# Altium schematic sheet Demux.SchDoc: QUTMS Shutdown V2.1 - Demux
size A3; Organization: QUT Motorsport; Address1: O-120; Address2: O Block; Address3: QUT Gardnes Point; Address4: Brisbane, 4000; DocumentNumber: 4; Revision: 6; SheetNumber: 4; SheetTotal: 4
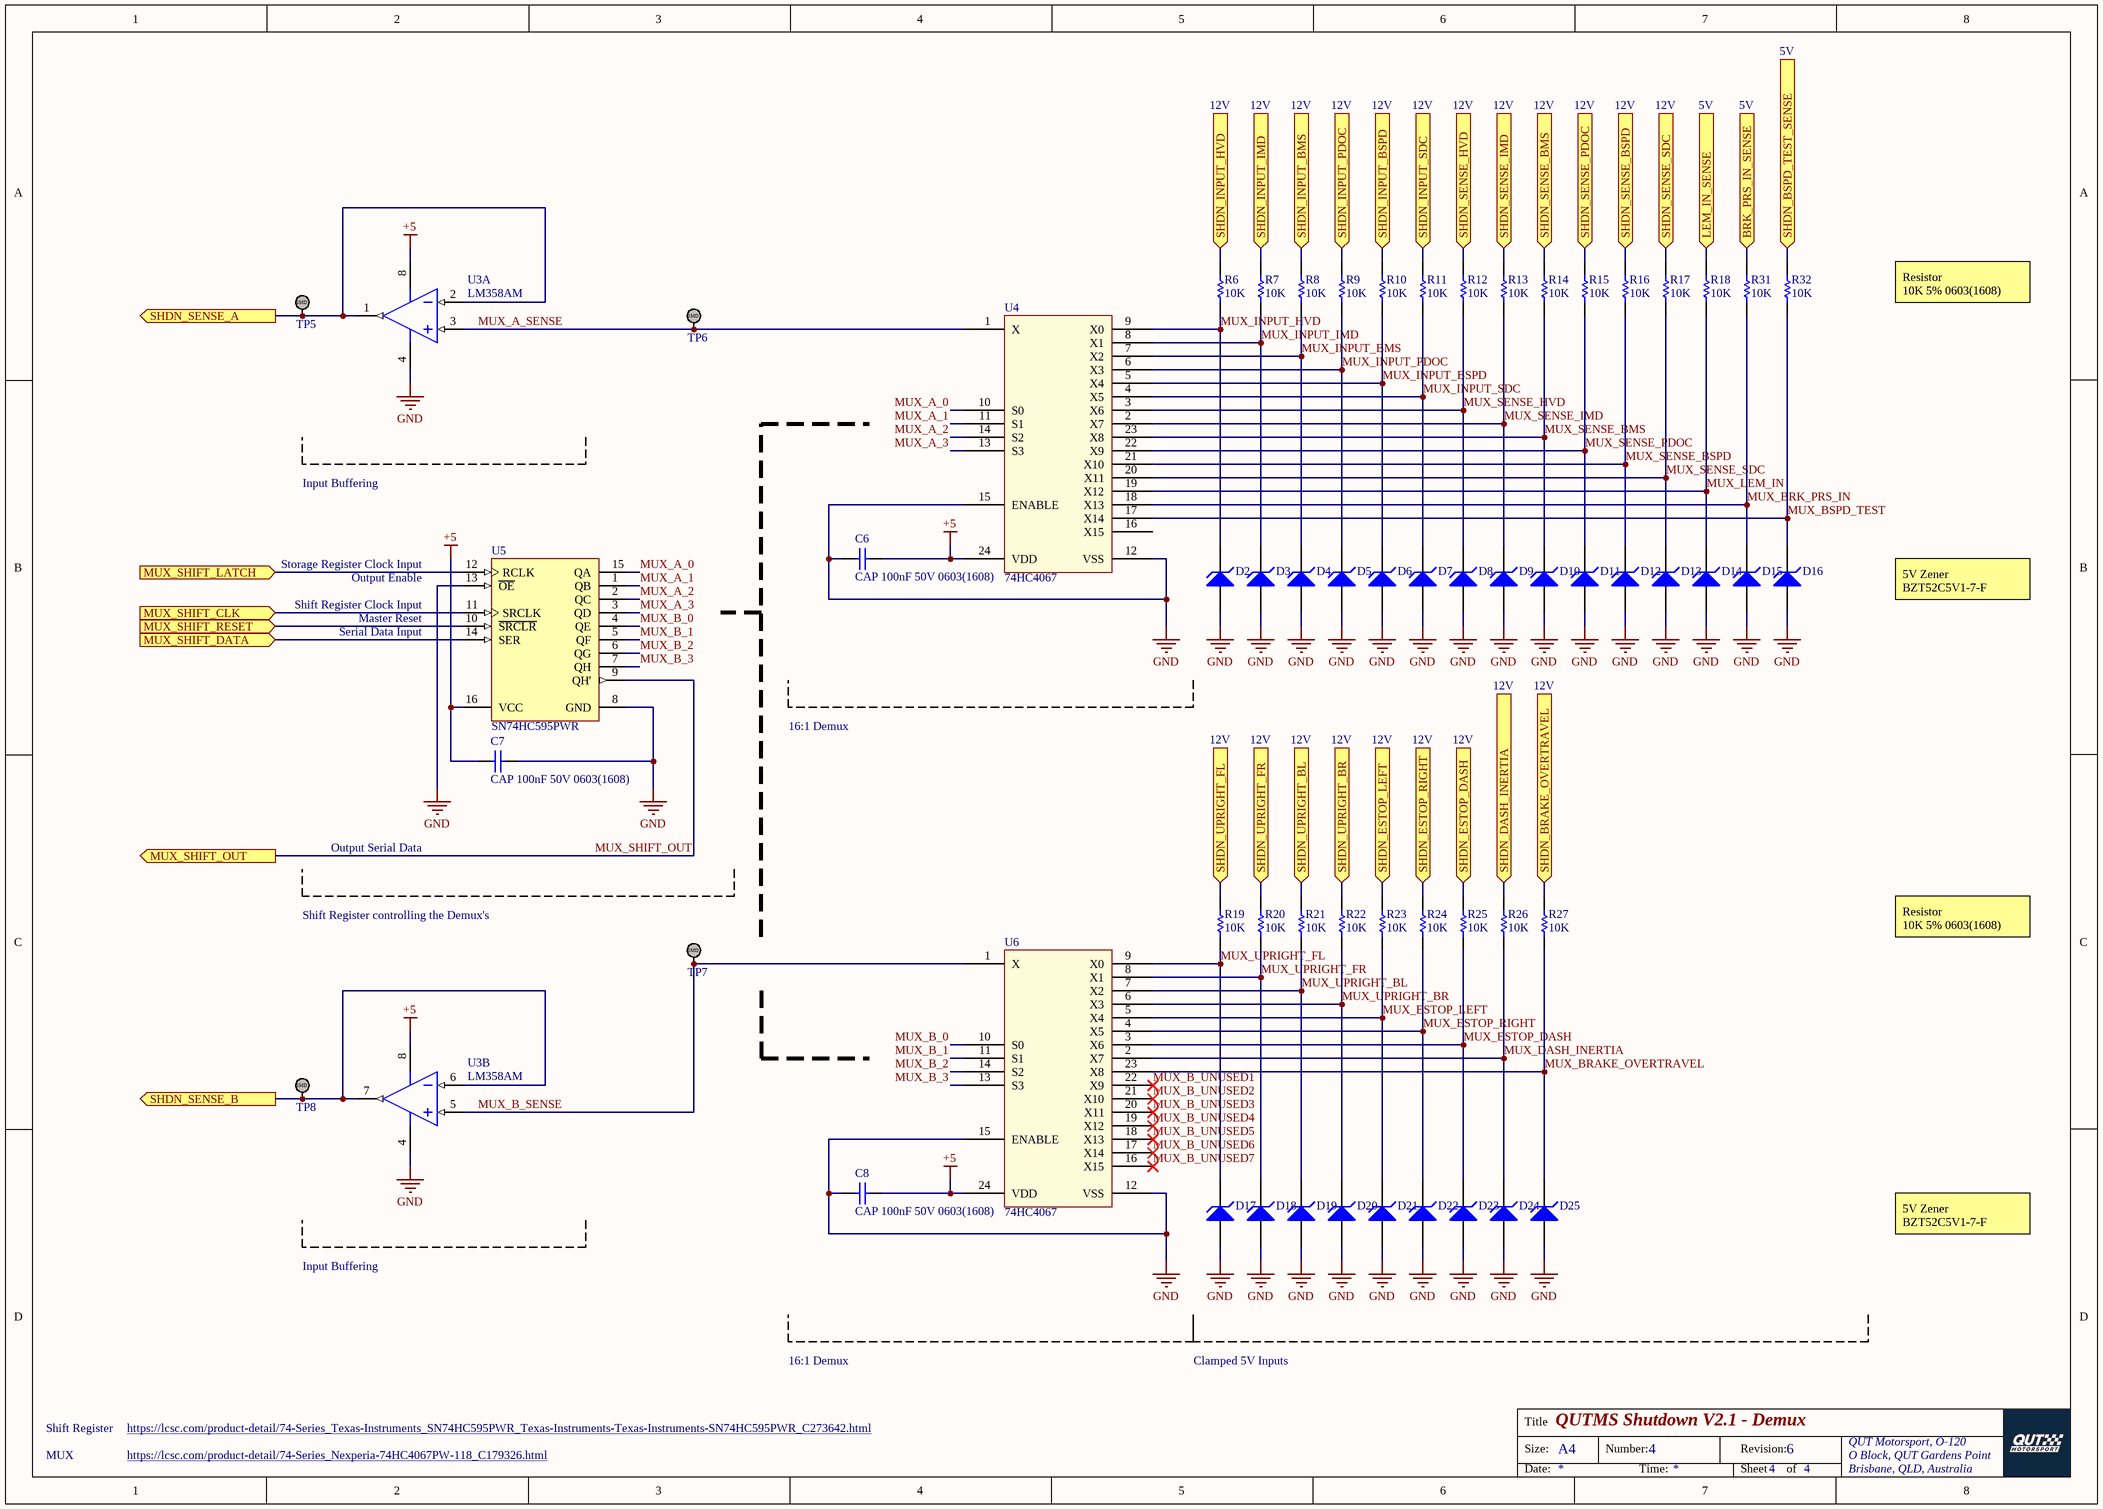
[diagram p0: Demux.SchDoc]

## Parts
C6  CAP 100nF 50V 0603(1608)  [CAPC0603(1608)100_L]
C7  CAP 100nF 50V 0603(1608)  [CAPC0603(1608)100_L]
C8  CAP 100nF 50V 0603(1608)  [CAPC0603(1608)100_L]
D2  BZT52C5V1-7-F  [DIOD-SOD123_V]  (value not drawn)
D3  BZT52C5V1-7-F  [DIOD-SOD123_V]  (value not drawn)
D4  BZT52C5V1-7-F  [DIOD-SOD123_V]  (value not drawn)
D5  BZT52C5V1-7-F  [DIOD-SOD123_V]  (value not drawn)
D6  BZT52C5V1-7-F  [DIOD-SOD123_V]  (value not drawn)
D7  BZT52C5V1-7-F  [DIOD-SOD123_V]  (value not drawn)
D8  BZT52C5V1-7-F  [DIOD-SOD123_V]  (value not drawn)
D9  BZT52C5V1-7-F  [DIOD-SOD123_V]  (value not drawn)
D10  BZT52C5V1-7-F  [DIOD-SOD123_V]  (value not drawn)
D11  BZT52C5V1-7-F  [DIOD-SOD123_V]  (value not drawn)
D12  BZT52C5V1-7-F  [DIOD-SOD123_V]  (value not drawn)
D13  BZT52C5V1-7-F  [DIOD-SOD123_V]  (value not drawn)
D14  BZT52C5V1-7-F  [DIOD-SOD123_V]  (value not drawn)
D15  BZT52C5V1-7-F  [DIOD-SOD123_V]  (value not drawn)
D16  BZT52C5V1-7-F  [DIOD-SOD123_V]  (value not drawn)
D17  BZT52C5V1-7-F  [DIOD-SOD123_V]  (value not drawn)
D18  BZT52C5V1-7-F  [DIOD-SOD123_V]  (value not drawn)
D19  BZT52C5V1-7-F  [DIOD-SOD123_V]  (value not drawn)
D20  BZT52C5V1-7-F  [DIOD-SOD123_V]  (value not drawn)
D21  BZT52C5V1-7-F  [DIOD-SOD123_V]  (value not drawn)
D22  BZT52C5V1-7-F  [DIOD-SOD123_V]  (value not drawn)
D23  BZT52C5V1-7-F  [DIOD-SOD123_V]  (value not drawn)
D24  BZT52C5V1-7-F  [DIOD-SOD123_V]  (value not drawn)
D25  BZT52C5V1-7-F  [DIOD-SOD123_V]  (value not drawn)
R6  10K  [RESC0603(1608)_N]
R7  10K  [RESC0603(1608)_N]
R8  10K  [RESC0603(1608)_N]
R9  10K  [RESC0603(1608)_N]
R10  10K  [RESC0603(1608)_N]
R11  10K  [RESC0603(1608)_N]
R12  10K  [RESC0603(1608)_N]
R13  10K  [RESC0603(1608)_N]
R14  10K  [RESC0603(1608)_N]
R15  10K  [RESC0603(1608)_N]
R16  10K  [RESC0603(1608)_N]
R17  10K  [RESC0603(1608)_N]
R18  10K  [RESC0603(1608)_N]
R19  10K  [RESC0603(1608)_N]
R20  10K  [RESC0603(1608)_N]
R21  10K  [RESC0603(1608)_N]
R22  10K  [RESC0603(1608)_N]
R23  10K  [RESC0603(1608)_N]
R24  10K  [RESC0603(1608)_N]
R25  10K  [RESC0603(1608)_N]
R26  10K  [RESC0603(1608)_N]
R27  10K  [RESC0603(1608)_N]
R31  10K  [RESC0603(1608)_N]
R32  10K  [RESC0603(1608)_N]
TP5  TestPoint_SMD  [TestPointSMD]  (value not drawn)
TP6  TestPoint_SMD  [TestPointSMD]  (value not drawn)
TP7  TestPoint_SMD  [TestPointSMD]  (value not drawn)
TP8  TestPoint_SMD  [TestPointSMD]  (value not drawn)
U3  LM358AM  [D0008A_M]  (parts A,B of 2)
U4  74HC4067  [74HC4067 TSSOP24]
U5  SN74HC595PWR  [PW0016A_L]
U6  74HC4067  [74HC4067 TSSOP24]

## Ports
BRK_PRS_IN_SENSE (in), LEM_IN_SENSE (in), MUX_SHIFT_CLK (in), MUX_SHIFT_DATA (in), MUX_SHIFT_LATCH (in), MUX_SHIFT_OUT (out), MUX_SHIFT_RESET (in), SHDN_BRAKE_OVERTRAVEL (in), SHDN_BSPD_TEST_SENSE (in), SHDN_DASH_INERTIA (in), SHDN_ESTOP_DASH (in), SHDN_ESTOP_LEFT (in), SHDN_ESTOP_RIGHT (in), SHDN_INPUT_BMS (in), SHDN_INPUT_BSPD (in), SHDN_INPUT_HVD (in), SHDN_INPUT_IMD (in), SHDN_INPUT_PDOC (in), SHDN_INPUT_SDC (in), SHDN_SENSE_A (out), SHDN_SENSE_B (out), SHDN_SENSE_BMS (in), SHDN_SENSE_BSPD (in), SHDN_SENSE_HVD (in), SHDN_SENSE_IMD (in), SHDN_SENSE_PDOC (in), SHDN_SENSE_SDC (in), SHDN_UPRIGHT_BL (in), SHDN_UPRIGHT_BR (in), SHDN_UPRIGHT_FL (in), SHDN_UPRIGHT_FR (in)

## Nets
+5: C6.1 C7.2 C8.1 U3.8(V+) U4.24(VDD) U5.16(VCC) U6.24(VDD)
GND: C6.2 C7.1 C8.2 D2.1(A) D3.1(A) D4.1(A) D5.1(A) D6.1(A) D7.1(A) D8.1(A) D9.1(A) D10.1(A) D11.1(A) D12.1(A) D13.1(A) D14.1(A) D15.1(A) D16.1(A) D17.1(A) D18.1(A) D19.1(A) D20.1(A) D21.1(A) D22.1(A) D23.1(A) D24.1(A) D25.1(A) U3.4(GND) U4.12(VSS) U4.15(ENABLE) U5.8(GND) U5.13(~{OE}) U6.12(VSS) U6.15(ENABLE)
BRK_PRS_IN_SENSE: R31.1 ; port BRK_PRS_IN_SENSE
LEM_IN_SENSE: R18.1 ; port LEM_IN_SENSE
MUX_A_0: U4.10(S0) U5.15(QA)
MUX_A_1: U4.11(S1) U5.1(QB)
MUX_A_2: U4.14(S2) U5.2(QC)
MUX_A_3: U4.13(S3) U5.3(QD)
MUX_A_SENSE: TP6.1 U3.3(INA+) U4.1(X)
MUX_B_0: U5.4(QE) U6.10(S0)
MUX_B_1: U5.5(QF) U6.11(S1)
MUX_B_2: U5.6(QG) U6.14(S2)
MUX_B_3: U5.7(QH) U6.13(S3)
MUX_B_SENSE: TP7.1 U3.5(INB+) U6.1(X)
MUX_B_UNUSED1: U6.22(X9)
MUX_B_UNUSED2: U6.21(X10)
MUX_B_UNUSED3: U6.20(X11)
MUX_B_UNUSED4: U6.19(X12)
MUX_B_UNUSED5: U6.18(X13)
MUX_B_UNUSED6: U6.17(X14)
MUX_B_UNUSED7: U6.16(X15)
MUX_BRAKE_OVERTRAVEL: D25.2(K) R27.2 U6.23(X8)
MUX_BRK_PRS_IN: D15.2(K) R31.2 U4.18(X13)
MUX_BSPD_TEST: D16.2(K) R32.2 U4.17(X14)
MUX_DASH_INERTIA: D24.2(K) R26.2 U6.2(X7)
MUX_ESTOP_DASH: D23.2(K) R25.2 U6.3(X6)
MUX_ESTOP_LEFT: D21.2(K) R23.2 U6.5(X4)
MUX_ESTOP_RIGHT: D22.2(K) R24.2 U6.4(X5)
MUX_INPUT_BMS: D4.2(K) R8.2 U4.7(X2)
MUX_INPUT_BSPD: D6.2(K) R10.2 U4.5(X4)
MUX_INPUT_HVD: D2.2(K) R6.2 U4.9(X0)
MUX_INPUT_IMD: D3.2(K) R7.2 U4.8(X1)
MUX_INPUT_PDOC: D5.2(K) R9.2 U4.6(X3)
MUX_INPUT_SDC: D7.2(K) R11.2 U4.4(X5)
MUX_LEM_IN: D14.2(K) R18.2 U4.19(X12)
MUX_SENSE_BMS: D10.2(K) R14.2 U4.23(X8)
MUX_SENSE_BSPD: D12.2(K) R16.2 U4.21(X10)
MUX_SENSE_HVD: D8.2(K) R12.2 U4.3(X6)
MUX_SENSE_IMD: D9.2(K) R13.2 U4.2(X7)
MUX_SENSE_PDOC: D11.2(K) R15.2 U4.22(X9)
MUX_SENSE_SDC: D13.2(K) R17.2 U4.20(X11)
MUX_SHIFT_CLK: U5.11(SRCLK) ; port MUX_SHIFT_CLK
MUX_SHIFT_DATA: U5.14(SER) ; port MUX_SHIFT_DATA
MUX_SHIFT_LATCH: U5.12(RCLK) ; port MUX_SHIFT_LATCH
MUX_SHIFT_OUT: U5.9(QH') ; port MUX_SHIFT_OUT
MUX_SHIFT_RESET: U5.10(~{SRCLR}) ; port MUX_SHIFT_RESET
MUX_UPRIGHT_BL: D19.2(K) R21.2 U6.7(X2)
MUX_UPRIGHT_BR: D20.2(K) R22.2 U6.6(X3)
MUX_UPRIGHT_FL: D17.2(K) R19.2 U6.9(X0)
MUX_UPRIGHT_FR: D18.2(K) R20.2 U6.8(X1)
SHDN_BRAKE_OVERTRAVEL: R27.1 ; port SHDN_BRAKE_OVERTRAVEL
SHDN_BSPD_TEST_SENSE: R32.1 ; port SHDN_BSPD_TEST_SENSE
SHDN_DASH_INERTIA: R26.1 ; port SHDN_DASH_INERTIA
SHDN_ESTOP_DASH: R25.1 ; port SHDN_ESTOP_DASH
SHDN_ESTOP_LEFT: R23.1 ; port SHDN_ESTOP_LEFT
SHDN_ESTOP_RIGHT: R24.1 ; port SHDN_ESTOP_RIGHT
SHDN_INPUT_BMS: R8.1 ; port SHDN_INPUT_BMS
SHDN_INPUT_BSPD: R10.1 ; port SHDN_INPUT_BSPD
SHDN_INPUT_HVD: R6.1 ; port SHDN_INPUT_HVD
SHDN_INPUT_IMD: R7.1 ; port SHDN_INPUT_IMD
SHDN_INPUT_PDOC: R9.1 ; port SHDN_INPUT_PDOC
SHDN_INPUT_SDC: R11.1 ; port SHDN_INPUT_SDC
SHDN_SENSE_A: TP5.1 U3.1(OUTA) U3.2(INA-) ; port SHDN_SENSE_A
SHDN_SENSE_B: TP8.1 U3.6(INB-) U3.7(OUTB) ; port SHDN_SENSE_B
SHDN_SENSE_BMS: R14.1 ; port SHDN_SENSE_BMS
SHDN_SENSE_BSPD: R16.1 ; port SHDN_SENSE_BSPD
SHDN_SENSE_HVD: R12.1 ; port SHDN_SENSE_HVD
SHDN_SENSE_IMD: R13.1 ; port SHDN_SENSE_IMD
SHDN_SENSE_PDOC: R15.1 ; port SHDN_SENSE_PDOC
SHDN_SENSE_SDC: R17.1 ; port SHDN_SENSE_SDC
SHDN_UPRIGHT_BL: R21.1 ; port SHDN_UPRIGHT_BL
SHDN_UPRIGHT_BR: R22.1 ; port SHDN_UPRIGHT_BR
SHDN_UPRIGHT_FL: R19.1 ; port SHDN_UPRIGHT_FL
SHDN_UPRIGHT_FR: R20.1 ; port SHDN_UPRIGHT_FR

Not connected (* = marked no-connect by the designer): U4 16(X15)

## Notes on the sheet
- 12V
- 5V
- Resistor
  10K 5% 0603(1608)
- Input Buffering
- Output Enable
- Storage Register Clock Input
- Serial Data Input
- Master Reset
- Shift Register Clock Input
- 5V Zener
  BZT52C5V1-7-F
- 16:1 Demux
- Output Serial Data
- Shift Register controlling the Demux's
- Clamped 5V Inputs
- MUX
- Shift Register
- https://lcsc.com/product-detail/74-Series_Nexperia-74HC4067PW-118_C179326.html
- https://lcsc.com/product-detail/74-Series_Texas-Instruments_SN74HC595PWR_Texas-Instruments-Texas-Instruments-SN74HC595PWR_C273642.html
- Title
- Size:
- A4
- Number:
- Revision:
- QUT Motorsport, O-120
- O Block, QUT Gardens Point
- Date:
- Time:
- Sheet
- of
- Brisbane, QLD, Australia
- (in symbol TestPoint_SMD) SMD

## Library data of the parts
C6-C8 = CMP-1035-02591-1: CAP 100nF 50V ±5% 0603 (1608 Metric) Thickness 1mm SMD; Tolerance: Â±5%; Case-Metric: 1608; Case-EIA: 0603; Rated Voltage: 50 V; Max Thickness: 1 mm; Technology: SMT; Value: 100nF
D2-D25 = CMP-2000-05976-1: Surface Mount Zener Diode, 5.1 V, -65 to 150 degC, 2-Pin SMD (SOD-123), RoHS, Tape and Reel; Manufacturer: DiodesIncorporated; Unit Weight: 0.000353oz; Zz - Zener Impedance: 60Ohms; Vz - Zener Voltage: 5.1V; Pd - Power Dissipation: 500mW; Zener Current: 5mA; Ir - Reverse Current: 2uA; Voltage Temperature Coefficient: -0.75mV/C; Configuration: Single; Voltage Tolerance: 6%; Height: 1.35mm; Width: 1.7mm; Minimum Operating Temperature: -65C; Series: BZT52C5; Package Description: 2-Pin Surface Mount Device, Body 2.7 x 1.55 mm; Length: 2.85mm; Mounting Technology: SurfaceMount; Brand: DiodesIncorporated; Factory Pack Quantity: 3000; Product Category: ZenerDiodes; RoHS: True; Manufacturer URL: http://www.diodes.com/; Termination Style: SMD/SMT; Package / Case: SOD-123; Packaging: Reel; Package Reference: SOD123; Datasheet Version: Rev. 37-2, 09/2012; Maximum Operating Temperature: +150C; Datasheet URL: http://www.diodes.com/_files/datasheets/ds18004.pdf; Mounting Style: SMD/SMT
R6-R27 R31 R32 = CMP-1012-00098-1: 10K 0.1W 5% 0603 (1608 Metric)  SMD; Case-EIA: 0603; Value: 10000.00 Ohm; Case-Metric: 1608; Technology: SMT; Tolerance: 5 %; Power: 0.1 W
U3 = CMP-0055-00796-3: Low Power Dual Operational Amplifier, 8-pin Narrow SOIC; Manufacturer: Texas Instruments; CompType: Amplifiers; PackageTopMarking: NSZXTT*LM*358AM; PowerWise: N; Code_JEDEC: MS-012-AA; RoHS: N; PinCount: 8; Package Reference: D0008A; ComponentLink1Description: Datasheet URL; ComponentLink1URL: http://www.ti.com/general/docs/lit/getliterature.tsp?genericPartNumber=LM358-N&fileType=pdf; Code_IPC: SOIC127P600-8; PackageDescription: SOIC Narrow, 4.9 x 3.9 x 1.45mm, 8 Lead, 1.27mm Pitch
U5 = CMP-0780-00192-3: 8-Bit Shift Registers With 3-State Output Registers, PW0016A, LARGE T&R; Manufacturer: Texas Instruments; VCC(Max)(V): 6; Bits: 8; Output Type: CMOS; 3-State Output: Yes; Output Drive (IOL/IOH)(Max)(mA): 7.8/-7.8; VCC(Min)(V): 2; Rating: Military; tpd @ Nom Voltage(Max)(ns): 34; ICC @ Nom Voltage(Max)(mA): 0.08; Technology Family: HC; F @ Nom Voltage(Max)(Mhz): 28; PackageReference: PW0016A; Generic Part Number: SN74HC595; Operating Temperature Range(C): -40 to 85; PackageVersion: http://www.ti.com/lit/ml/mpds361/mpds361.pdf; Code_JEDEC: MO-153; DatasheetVersion: SCLS041H; Voltage(Nom)(V): 6; Input Type: CMOS